# Altium schematic sheet Housekeeping.SchDoc: FPGA Motherboard for Digital Multiplexed Readout, McGill U.
size A; DocumentNumber: DfMUX17; Revision: Rev0, Prototype; SheetNumber: 17; SheetTotal: 27; PageSetup: Record=PageOptions|CenterHorizontal=True|CenterVertical=True|PrintScale=1.05|XCorrection=1.00|YCorrection=1.00|PrintKind=0|BorderSize=5000000|LeftOffset=0|BottomOffset=0|Orientation=2|PaperLength=1000|PaperWidth=1000|Scale=100|PaperSource=7|PrintQuality=-4|MediaType=1|DitherType=10|PaperKind=Letter|PrintScaleMode=1
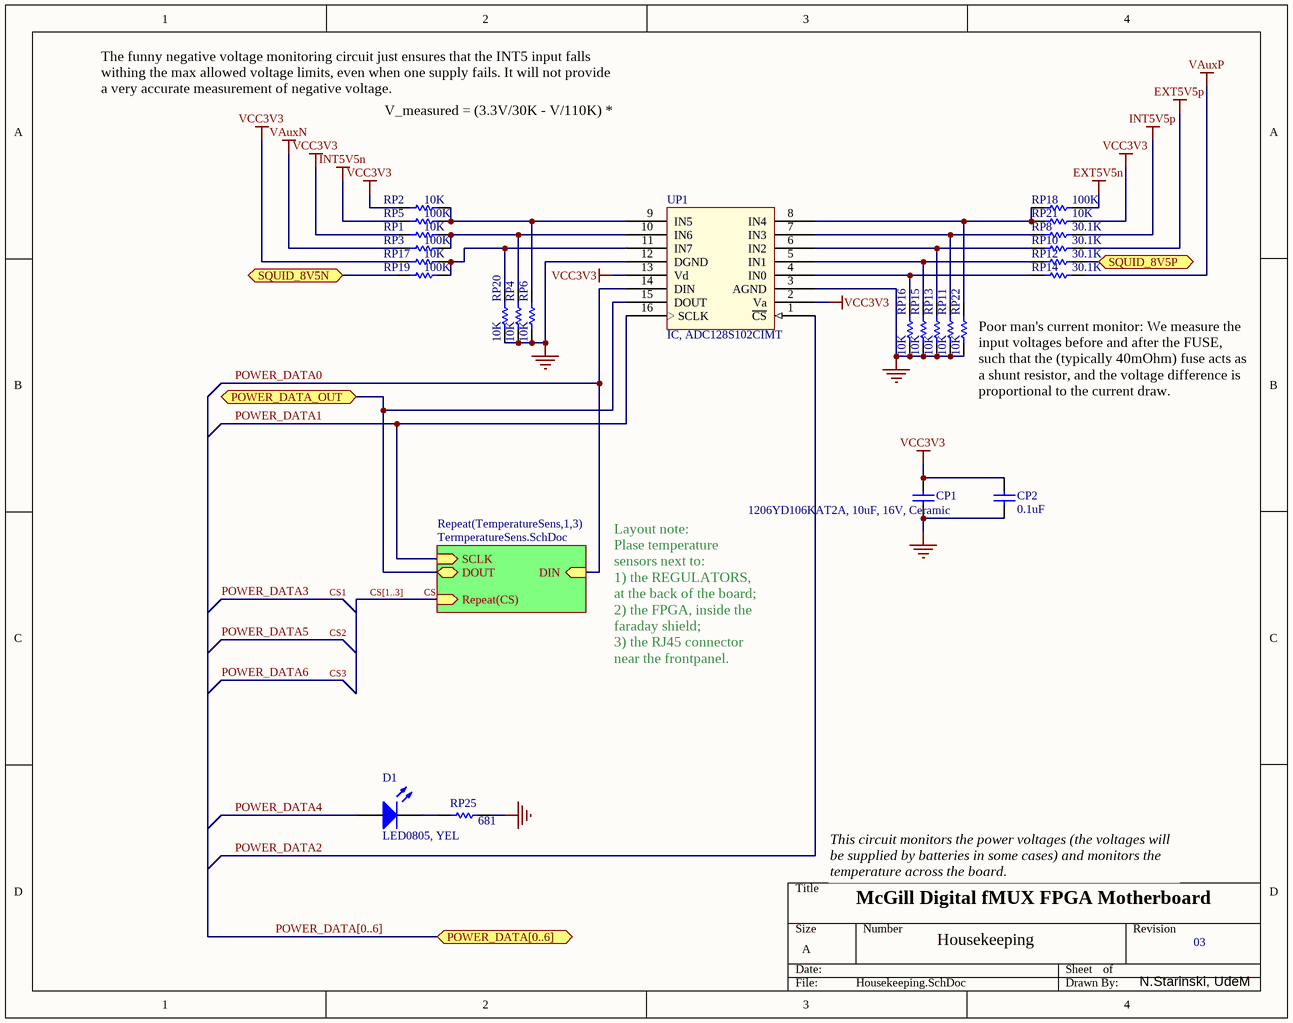
[diagram p0: Housekeeping.SchDoc]

## Parts
CP1  1206YD106KAT2A, 10uF, 16V, Ceramic  [CC3225-1210]
CP2  0.1uF  [CC1608-0603]
D1  LED0805, YEL  [SMD _LED]
RP1  10K  [CR1608-0603]
RP2  10K  [CR1608-0603]
RP3  100K  [CR1608-0603]
RP4  10K  [CR1608-0603]
RP5  100K  [CR1608-0603]
RP6  10K  [CR1608-0603]
RP8  30.1K  [CR1608-0603]
RP10  30.1K  [CR1608-0603]
RP11  10K  [CR1608-0603]
RP12  30.1K  [CR1608-0603]
RP13  10K  [CR1608-0603]
RP14  30.1K  [CR1608-0603]
RP15  10K  [CR1608-0603]
RP16  10K  [CR1608-0603]
RP17  10K  [CR1608-0603]
RP18  100K  [CR1608-0603]
RP19  100K  [CR1608-0603]
RP20  10K  [CR1608-0603]
RP21  10K  [CR1608-0603]
RP22  10K  [CR1608-0603]
RP25  681  [CR1608-0603]
UP1  IC, ADC128S102CIMT  [SSO-G16/X.45]

## Sub-sheets
Repeat(TemperatureSens,1,3) = TermperatureSens.SchDoc: SCLK (in), Repeat(CS) (in), DOUT (bidir), DIN (in)

## Ports
POWER_DATA[0..6], POWER_DATA_OUT (bidir), SQUID_8V5N, SQUID_8V5P

## Nets
EXT5V5n: RP18.2
EXT5V5p: RP10.2
GND: CP1.1 CP2.1 RP4.1 RP6.1 RP11.1 RP13.1 RP15.1 RP16.1 RP20.1 RP22.1 RP25.2 UP1.3(AGND) UP1.12(DGND)
INT5V5n: RP5.1
INT5V5p: RP8.2
VAuxN: RP3.1
VAuxP: RP14.2
VCC3V3: CP1.2 CP2.2 RP1.1 RP2.1 RP17.1 RP21.2 UP1.2(Va) UP1.13(Vd)
CS: sheet Repeat(TemperatureSens,1,3)/Repeat(CS)
POWER_DATA0: UP1.14(DIN) ; sheet Repeat(TemperatureSens,1,3)/DIN
POWER_DATA1: UP1.16(SCLK) ; sheet Repeat(TemperatureSens,1,3)/SCLK
POWER_DATA2: UP1.1(~{CS})
POWER_DATA4: D1.1(A)
POWER_DATA_OUT: UP1.15(DOUT) ; port POWER_DATA_OUT, sheet Repeat(TemperatureSens,1,3)/DOUT
SQUID_8V5N: RP19.1 ; port SQUID_8V5N
SQUID_8V5P: RP12.2 ; port SQUID_8V5P
NetD1_2: D1.2(K) RP25.1
NetRP1_2: RP1.2 RP3.2 RP4.2 UP1.10(IN6)
NetRP2_2: RP2.2 RP5.2 RP6.2 UP1.9(IN5)
NetRP8_1: RP8.1 RP11.2 UP1.7(IN3)
NetRP10_1: RP10.1 RP13.2 UP1.6(IN2)
NetRP12_1: RP12.1 RP15.2 UP1.5(IN1)
NetRP14_1: RP14.1 RP16.2 UP1.4(IN0)
NetRP17_2: RP17.2 RP19.2 RP20.2 UP1.11(IN7)
NetRP18_1: RP18.1 RP21.1 RP22.2 UP1.8(IN4)

## Buses and harness runs
bus CS[1..3]
bus POWER_DATA[0..6] = port POWER_DATA[0..6]

## Notes on the sheet
- The funny negative voltage monitoring circuit just ensures that the INT5 input falls withing the max allowed voltage limits, even when one supply fails. It will not provide a very accurate measurement of negative voltage.
- V_measured = (3.3V/30K - V/110K) * 10K
- (near RP22) Poor man's current monitor: We measure the input voltages before and after the FUSE, such that the (typically 40mOhm) fuse acts as a shunt resistor, and the voltage difference is proportional to the current draw.
- Layout note:
  Plase temperature sensors next to:
  1) the REGULATORS, at the back of the board;
  2) the FPGA, inside the faraday shield;
  3) the RJ45 connector near the frontpanel.
- This circuit monitors the power voltages (the voltages will be supplied by batteries in some cases) and monitors the temperature across the board.
- McGill Digital fMUX FPGA Motherboard
- Housekeeping
- 03
- N.Starinski, UdeM

## Library data of the parts
CP1 = Cap Semi: CAP POL 1206YD106KAT2A; Published: 8-Jun-2000; LatestRevisionDate: 17-Jul-2002; LatestRevisionNote: Re-released for DXP Platform.; PackageReference: C1206; Publisher: Altium Limited
CP2 = Cap Semi: Capacitor (Semiconductor SIM Model); Published: 8-Jun-2000; LatestRevisionDate: 17-Jul-2002; LatestRevisionNote: Re-released for DXP Platform.; PackageReference: C1206; Publisher: Altium Limited
D1 = LED3: LED 0805 LTST-C170YKT; Published: 8-Jun-2000; LatestRevisionDate: 17-Dec-2003; LatestRevisionNote: PCB Footprint replaced.; Publisher: Altium Limited
RP1 RP2 RP4 RP6 RP8 RP10-RP17 RP20-RP22 RP25 = Res Semi: Resistor 0603; Published: 8-Jun-2000; LatestRevisionDate: 17-Jul-2002; LatestRevisionNote: Re-released for DXP Platform.; Publisher: Altium Limited
RP3 RP5 RP18 RP19 = Res Semi: Semiconductor Resistor; Published: 8-Jun-2000; LatestRevisionDate: 17-Jul-2002; LatestRevisionNote: Re-released for DXP Platform.; Publisher: Altium Limited
UP1 = ADC128S102: 8-Channels, 500kSPS to 1 MSPS, 12-Bit ADC